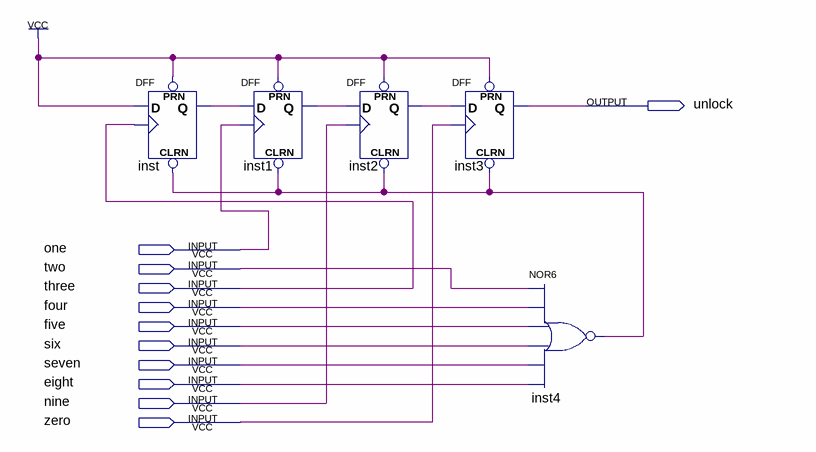
[diagram p0: schematic sheet]
// Quartus schematic digital.bdf as structural Verilog: 5 symbols, 11 pins
module digital (
  input  one,
  input  two,
  input  three,
  input  four,
  input  five,
  input  six,
  input  seven,
  input  eight,
  input  nine,
  input  zero,
  output unlock
);

  wire inst1_q, inst2_q, inst4_out, inst_q;

  DFF inst (.CLRN(inst4_out), .CLK(three), .D(1'b1), .PRN(1'b1), .Q(inst_q));
  DFF inst1 (.CLRN(inst4_out), .CLK(one), .D(inst_q), .PRN(1'b1), .Q(inst1_q));
  DFF inst2 (.CLRN(inst4_out), .CLK(nine), .D(inst1_q), .PRN(1'b1), .Q(inst2_q));
  DFF inst3 (.CLRN(inst4_out), .CLK(zero), .D(inst2_q), .PRN(1'b1), .Q(unlock));
  nor inst4 (inst4_out, two, four, five, six, seven, eight);
endmodule
